# Altium schematic sheet proj_arhipov_elements_control.SchDoc: =title_line_1 + title_line_2
size 420 x 297 mm; SheetNumber: 4
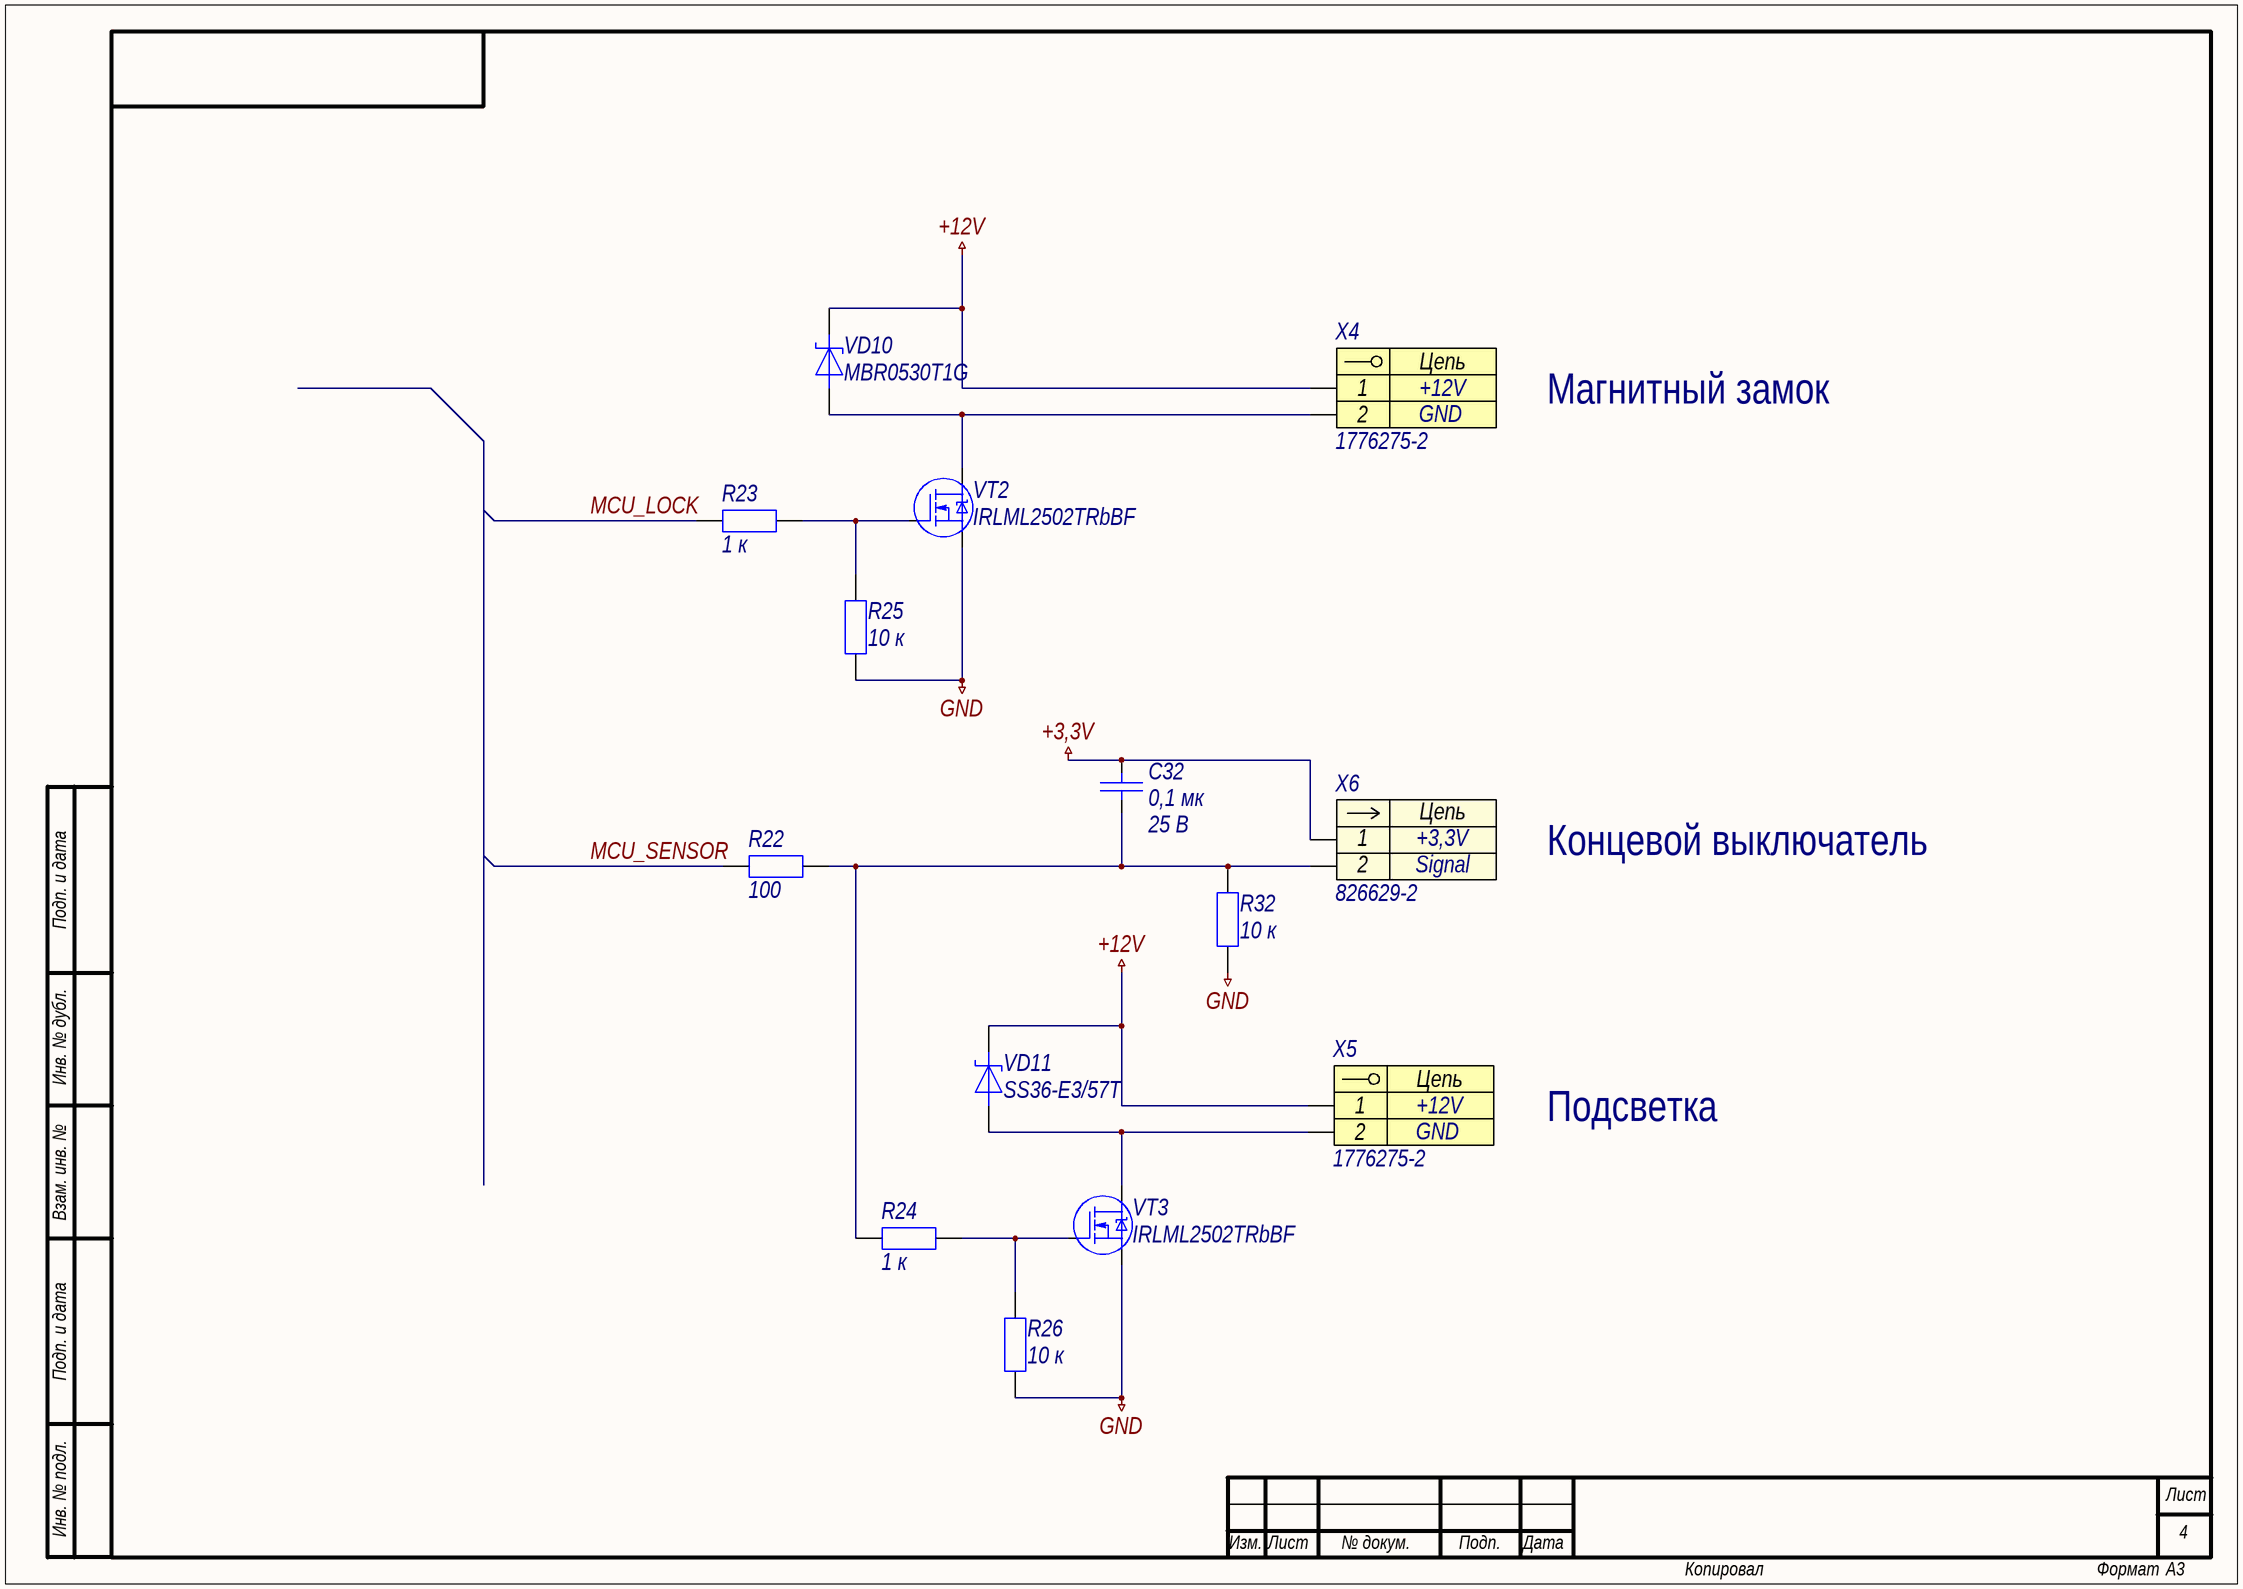
[diagram p0: proj_arhipov_elements_control.SchDoc]

## Parts
C32  0,1 мк  Напряжение: 25 В  [C0603]
R22  100  [R0603]
R23  1 к  [R0603]
R24  1 к  [R0603]
R25  10 к  [R0603]
R26  10 к  [R0603]
R32  10 к  [R0603]
VD10  MBR0530T1G  [SOD-123]
VD11  SS36-E3/57T  [DO-214AB]
VT2  IRLML2502TRbBF  [SOT-23-3]
VT3  IRLML2502TRbBF  [SOT-23-3]
X4  1776275-2  [1776275-2]
X5  1776275-2  [1776275-2]
X6  826629-2  [826629-2]

## Nets
+3,3V: C32.2 X6.1
+12V: VD10.1 VD11.1 X4.1 X5.2
GND: R25.1 R26.1 R32.1 VT2.2(S) VT3.2(S)
MCU_LOCK: R23.1
MCU_SENSOR: R22.1
NetC32_1: C32.1 R22.2 R24.1 R32.2 X6.2
NetR23_2: R23.2 R25.2 VT2.1(G)
NetR24_2: R24.2 R26.2 VT3.1(G)
NetVD10_2: VD10.2 VT2.3(D) X4.2
NetVD11_2: VD11.2 VT3.3(D) X5.1

## Notes on the sheet
- Магнитный замок
- Концевой выключатель
- Подсветка
- Подп. и дата
- Инв. № дубл.
- Взам. инв. №
- Инв. № подл.
- Лист
- Изм.
- № докум.
- Подп.
- Дата
- Копировал
- Формат
- А3
- (in symbol x0005) Цепь
- (in symbol x0008) Цепь

## Library data of the parts
C32 = c0058: =Описание; ID: c0058; Фамилия: Паньков; Описание: Конденсатор керамический чип 0603 100 нФ 25 В ±10 %; Наименование: CC0603KRX7R8BB104; Производитель: YAGEO Corp.; Отклонение: ±10 %; Рабочие температуры: от –55 °С до +125 °С; Температурный коэффициент емкости: X7R; Корпус: 0603; Номинал: 0,1 мк; Номинальное напряжение: 25 В; HelpURL: https://www.yageo.com/upload/media/product/productsearch/datasheet/mlcc/UPY-GPHC_X7R_6.3V-to-50V_20.pdf
R22 = r0007: =Описание; ID: r0007; Фамилия: Самарин; Описание: Резистор чип 0603 100 Ом ±1 % 0,1 Вт; Наименование: RC0603FR‍‐07100RL; Производитель: YAGEO Corp.; Отклонение: ±1 %; Номинальное напряжение: 75 В; Номинальный ток: 1 А; Рабочие температуры: от –55 °С до +155 °С; Корпус: 0603; Примечание: Ряд E24; Номинал: 100; HelpURL: https://www.yageo.com/upload/media/product/productsearch/datasheet/rchip/PYu-RC_Group_51_RoHS_L_11.pdf
R23 R24 = r0031: =Описание; ID: r0031; Фамилия: Ларионов; Описание: Резистор чип 0603 1 кОм ±1 % 0,1 Вт; Наименование: RC0603FR-071KL; Производитель: YAGEO Corp.; Отклонение: ±1 %; Номинальное напряжение: 75 В; Номинальный ток: 1 А; Рабочие температуры: от –55 °С до +155 °С; Корпус: 0603; Примечание: Ряд E24; Номинал: 1 к; HelpURL: https://www.yageo.com/upload/media/product/productsearch/datasheet/rchip/PYu-RC_Group_51_RoHS_L_11.pdf
R25 R26 R32 = r0060: =Описание; ID: r0060; Фамилия: Самарин; Описание: Резистор чип 0603 10 кОм ±1 % 0,1 Вт; Наименование: RC0603FR-0710KL; Производитель: YAGEO Corp.; Отклонение: ±1 %; Номинальное напряжение: 75 В; Номинальный ток: 1 А; Рабочие температуры: от –55 °С до +155 °С; Корпус: 0603; Примечание: Ряд E24; Номинал: 10 к; HelpURL: https://www.yageo.com/upload/media/product/productsearch/datasheet/rchip/PYu-RC_Group_51_RoHS_L_11.pdf
VD10 = vd0001: =Описание; ID: vd0001; Фамилия: Шкабара; Описание: Диод Шоттки 30 В 0,5 А; Производитель: ON Semiconductor; Максимальное прямое напряжение: 0,43 В; Максимальное обратное напряжение: 30 В; Максимальный прямой ток: 0,5 А; Рабочие температуры: от –65 °С до +125 °С; Наименование: MBR0530T1G; Корпус: SOD-123; HelpURL: https://www.onsemi.com/products/discretes-drivers/diodes-rectifiers/schottky-diodes-schottky-rectifiers/mbr0530t1g
VD11 = vd0005: =Описание; ID: vd0005; Фамилия: Жернаков; Описание: Диод Шоттки 60 В 3 А; Производитель: Vishay Intertechnology, Inc.; Максимальное прямое напряжение: 0,75 В; Максимальное обратное напряжение: 60 В; Максимальный прямой ток: 3 А; Рабочие температуры: от –55 °С до +150 °С; Наименование: SS36-E3/57T; Корпус: DO-214AB; HelpURL: https://www.vishay.com/product?docid=88751
VT2 VT3 = vt0002: =Описание; ID: vt0002; Фамилия: Паньков; Описание: Полевой N-канальный МДП-транзистор 20 В 4,2 А; Производитель: Infineon Technologies AG; Напряжение затвор — исток: ±12 В; Напряжение сток — исток: 20 В; Ток стока: 4,2 А; Сопротивление сток — исток: 0,080 Ом; Рабочие температуры: от –55 °С до +150 °С; Наименование: IRLML2502TRbBF; Корпус: SOT-23-3; HelpURL: https://www.infineon.com/cms/en/product/power/mosfet/12v-300v-n-channel-power-mosfet/irlml2502/
X4 X5 = x0005: =Описание; Contact_1: +12V; Contact_2: GND; ID: x0005; Фамилия: Паньков; Описание: Terminal Block 2 pin 3,5 мм; Производитель: TE Connectivity; Наименование: 1776275-2; HelpURL: https://www.te.com/usa-en/product-1776275-2.html
X6 = x0008: =Описание; Contact_1: +3,3V; Contact_2: Signal; ID: x0008; Фамилия: Архипов; Описание: PLS 2 pin 2,54 мм вилка прямой; Производитель: TE Connectivity; Наименование: 826629-2; HelpURL: https://www.te.com/usa-en/product-826629-2.html